# EAGLE design AD5254 Breakout Board V3 (EAGLE 6.5.0)
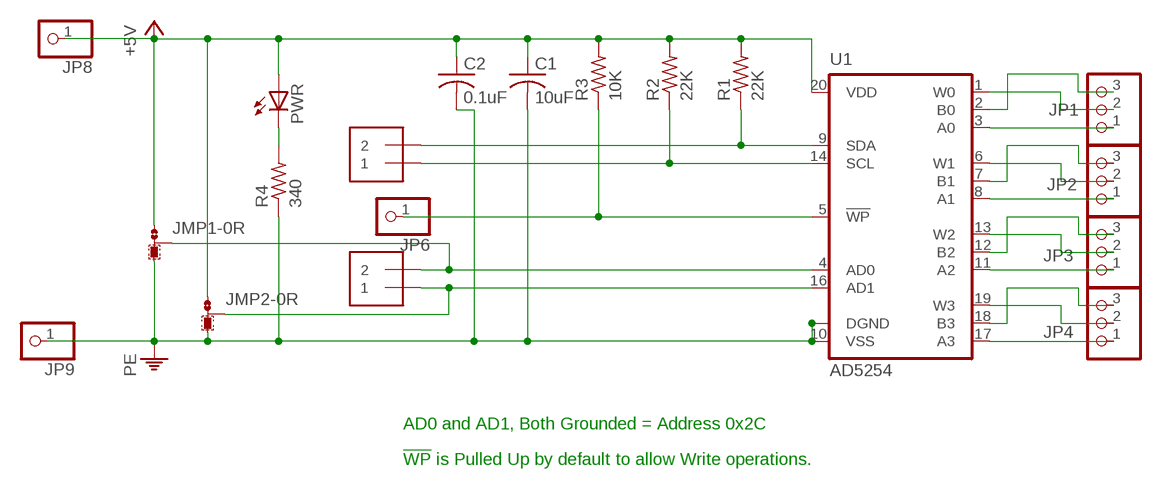
[diagram p0: schematic, sheet 1]

## Parts
C1  10uF  C-USC0805  [C0805]
C2  0.1uF  C-USC0805  [C0805]
JMP1  0R-JUMPA  [A0R-JMP]
JMP2  0R-JUMPA  [A0R-JMP]
JP1  PINHD-1X3CB  [1X03-CLEANBIG]
JP2  PINHD-1X3CB  [1X03-CLEANBIG]
JP3  PINHD-1X3CB  [1X03-CLEANBIG]
JP4  PINHD-1X3CB  [1X03-CLEANBIG]
JP5  PINHD-1X2GD  [1X02-CLEANBIG]
JP6  PINHD-1X1CB  [1X01-CLEANBIG]
JP7  PINHD-1X2GD  [1X02-CLEANBIG]
JP8  PINHD-1X1CB  [1X01-CLEANBIG]
JP9  PINHD-1X1CB  [1X01-CLEANBIG]
PWR  LED3MM  [LED3MM]
R1  22K  R-US_M0805  [M0805]
R2  22K  R-US_M0805  [M0805]
R3  10K  R-US_M0805  [M0805]
R4  340  R-US_M0805  [M0805]
U1  AD5254  [AD5254]

## Nets
+5V: C1.1 C2.1 JMP1.1 JMP2.1 JP8.1 PWR.A R1.2 R2.2 R3.2 U1.20(VDD)
GND: C1.2 C2.2 JMP1.3 JMP2.3 JP9.1 R4.1 U1.10(VSS) U1.15(DGND) ; supply symbol labelled PE
N$1: JP1.2 U1.1(W0)
N$2: JP6.1 R3.1 U1.5(!WP)
N$3: JP1.3 U1.2(B0)
N$4: JP1.1 U1.3(A0)
N$5: JP2.1 U1.8(A1)
N$6: JP3.1 U1.11(A2)
N$7: JP4.1 U1.17(A3)
N$8: JP4.3 U1.18(B3)
N$9: JP4.2 U1.19(W3)
N$10: JP2.3 U1.7(B1)
N$11: JP2.2 U1.6(W1)
N$12: JP3.3 U1.12(B2)
N$13: JP3.2 U1.13(W2)
N$14: JP5.2 R1.1 U1.9(SDA)
N$15: JP5.1 R2.1 U1.14(SCL)
N$16: JMP1.2 JP7.2 U1.4(AD0)
N$17: JMP2.2 JP7.1 U1.16(AD1)
N$18: PWR.K(C) R4.2

## Notes on the sheet
- AD0 and AD1, Both Grounded = Address 0x2C
- !WP! is Pulled Up by default to allow Write operations.

## Library data of the parts
C1 C2 = resistor:C-US: CAPACITOR, American symbol
JMP1 JMP2 = jump-0r-smd:0R-JUMP: SMD 0R 0805 Jumper
JP1-JP4 = adafruit:PINHD-1X3: PIN HEADER
JP5 JP7 = adafruit:PINHD-1X2
JP6 JP8 JP9 = adafruit:PINHD-1X1: Pin header 1x1 for 0.1" spacing With round pins
PWR = led:LED: LED OSRAM: - CHIPLED LG R971, LG N971, LY N971, LG Q971, LY Q971, LO R971, LY R971 LH N974, LH R974 LS Q976, LO Q976, LY Q976 LO Q996 - Hyper CHIPLED LW Q18S LB Q993, LB Q99A, LB R99A - SideLED LS A670, LO A670, LY A670, LG A670, LP A670 LB A673, LV A673, LT A673, LW A673 LH A674 LY A675 LS A676, LA A676, LO A676, LY A676, LW A676 LS A679, LY A679, LG A679 - Hyper Micro SIDELED® LS Y876, LA Y876, LO Y876, LY Y876 LT Y87S - SmartLED LW L88C, LW L88S LB L89C, LB L89S, LG L890 LS L89K, LO L89K, LY L89K LS L896, LA L896, LO L896, LY L896 - TOPLED LS T670, LO T670, LY T670, LG T670, LP T670 LSG T670, LSP T670, LSY T670, LOP T670, LYG T670 LG T671, LOG T671, LSG T671 LB T673, LV T673, LT T673, LW T673 LH T674 LS T676, LA T676, LO T676, LY T676, LB T676, LH T676, LSB T676, LW T676 LB T67C, LV T67C, LT T67C, LS T67K, LO T67K, LY T67K, LW E67C LS E67B, LA E67B, LO E67B, LY E67B, LB E67C, LV E67C, LT E67C LW T67C LS T679, LY T679, LG T679 LS T770, LO T770, LY T770, LG T770, LP T770 LB T773, LV T773, LT T773, LW T773 LH T774 LS E675, LA E675, LY E675, LS T675 LS T776, LA T776, LO T776, LY T776, LB T776 LHGB T686 LT T68C, LB T68C - Hyper Mini TOPLED® LB M676 - Mini TOPLED Santana® LG M470 LS M47K, LO M47K, LY M47K Source: http://www.osram.convergy.de LUXEON: - LUMILED® LXK2-PW12-R00, LXK2-PW12-S00, LXK2-PW14-U00, LXK2-PW14-V00 LXK2-PM12-R00, LXK2-PM12-S00, LXK2-PM14-U00 LXK2-PE12-Q00, LXK2-PE12-R00, LXK2-PE12-S00, LXK2-PE14-T00, LXK2-PE14-U00 LXK2-PB12-K00, LXK2-PB12-L00, LXK2-PB12-M00, LXK2-PB14-N00, LXK2-PB14-P00, LXK2-PB14-Q00 LXK2-PR12-L00, LXK2-PR12-M00, LXK2-PR14-Q00, LXK2-PR14-R00 LXK2-PD12-Q00, LXK2-PD12-R00, LXK2-PD12-S00 LXK2-PH12-R00, LXK2-PH12-S00 LXK2-PL12-P00, LXK2-PL12-Q00, LXK2-PL12-R00 Source: www.luxeon.com KINGBRIGHT: KA-3528ASYC Source: www.kingbright.com
R1-R3 = adafruit:R-US_: RESISTOR, American symbol
R4 = resistor:R-US_: RESISTOR, American symbol
U1 = AD5254 Library Part:AD5254: Quad 64-/256-Position i2C Nonvolatile Memory Digital Potentiometer

## Board
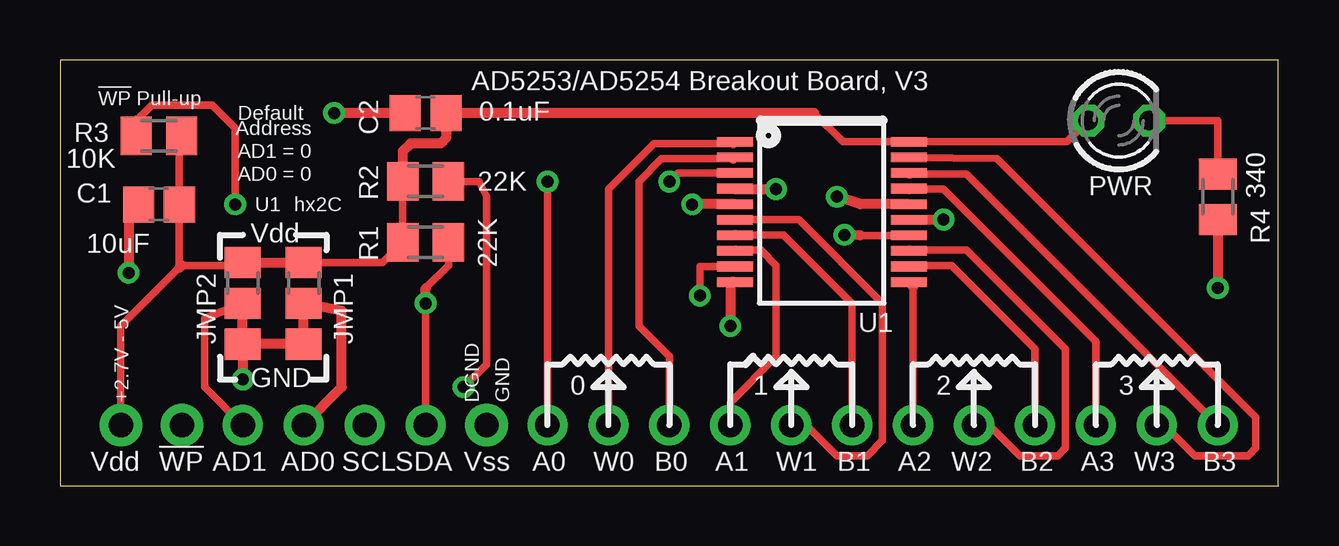
[diagram p1: board, top side]
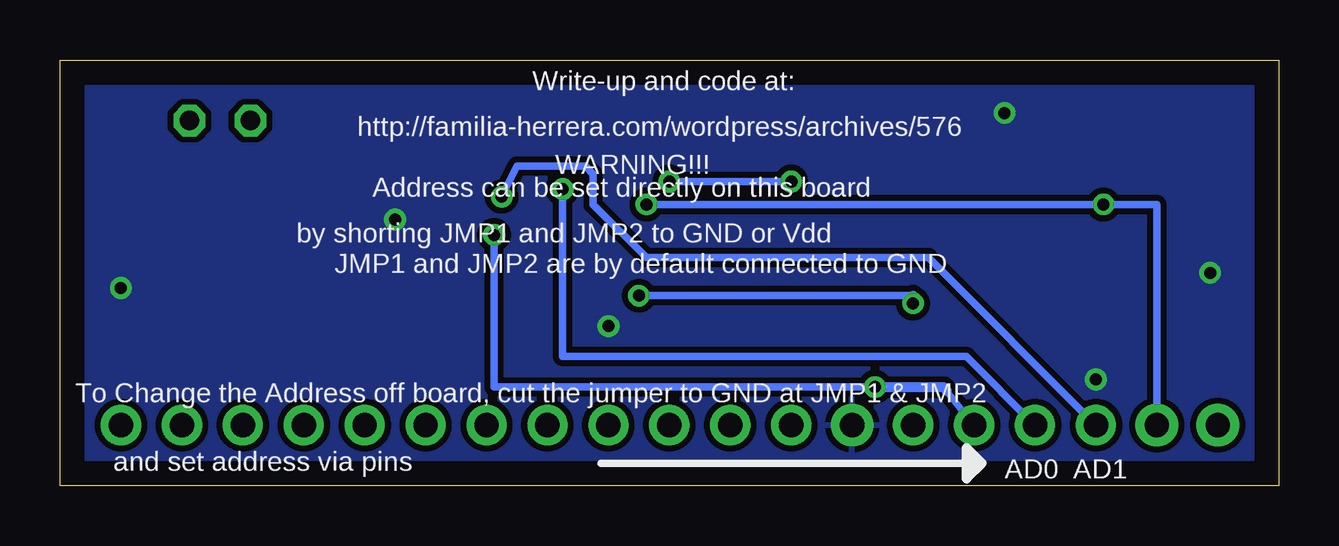
[diagram p2: board, bottom side, seen from below]

Size 50.8 x 17.77 mm. Coordinates in mm from the lower left corner, seen from the top.
Outline: 50.79,0 50.79,17.77 0,17.77 0,0 50.8,0
Copper layers (1*16): Top 0.035mm / dielectric 1.5mm / Bottom 0.035mm
Design rules "default *": minimum track width 10mil, minimum drill 24mil, track to track 8mil, track to pad 8mil, pad to pad 8mil, via to via 8mil, smd to smd 8mil, copper to edge 40mil, drill to drill 8mil, minimum pad ring 10mil, minimum via ring 8mil, stop-mask expansion 4mil, vias tented up to drill 50mil, thermal gap 10mil
tRestrict: area 29.2,7.6 to 34.3,15.2
bRestrict: area 50.5,0.3 to 50.5,5.1

### Footprints (pad centres in the part's own frame; a part is rotated, then mirrored left to right if it is on the bottom)
C0805 = smd 1.3 x 1.5: 1 -0.85,0; 2 0.85,0
A0R-JMP = smd 1.5 x 1.3: 1 0,1.7; 2 0,0; 3 0,-1.7
1X03-CLEANBIG = drill 1.016 pad 1.676: 1 -2.54,0; 2 0,0; 3 2.54,0
1X02-CLEANBIG = drill 1.016 pad 1.676: 1 -1.27,0; 2 1.27,0
1X01-CLEANBIG = drill 1.016 pad 1.778: 1 0,0
LED3MM = drill 0.813 octagon: A -1.27,0; K 1.27,0
M0805 = smd 1.3 x 1.6: 1 -0.95,0; 2 0.95,0
AD5254 = smd 0.4 x 1.5: 1 -2.925,-3.625; 2 -2.275,-3.625; 3 -1.625,-3.625; 4 -0.975,-3.625; 5 -0.325,-3.625; 6 0.325,-3.625; 7 0.975,-3.625; 8 1.625,-3.625; 9 2.275,-3.625; 10 2.925,-3.625; 11 2.925,3.625; 12 2.275,3.625; 13 1.625,3.625; 14 0.975,3.625; 15 0.325,3.625; 16 -0.325,3.625; 17 -0.975,3.625; 18 -1.625,3.625; 19 -2.275,3.625; 20 -2.925,3.625

### Placement (x,y rotation side)
C1  4.13,11.75 180 top
C2  15.24,15.56 180 top
JMP1  10.16,7.62 0 top
JMP2  7.62,7.62 0 top
JP1  22.86,2.54 0 top
JP2  30.48,2.54 0 top
JP3  38.1,2.54 0 top
JP4  45.72,2.54 0 top
JP5  13.97,2.54 0 top
JP6  5.08,2.54 0 top
JP7  8.89,2.54 0 top
JP8  2.54,2.54 0 top
JP9  17.78,2.54 0 top
PWR  44.13,15.24 0 top
R1  15.24,10.16 180 top
R2  15.24,12.7 180 top
R3  4.13,14.61 0 top
R4  48.26,12.06 90 top
U1  31.75,11.43 270 top

### Tracks (layer width: path | path; a pad name or v marks a point on that pad's centre or on a via)
+5V
  Top 0.305: JP8.1 2.54,6.67 4.98,9.11 C1.1 4.98,14.51 | 5.08,9.21 7.51,9.21 | JMP1.1 13.45,9.32 R1.2 R2.2 | PWR.A 41.98,14.36 U1.20 32.63,14.36 31.43,15.56
  Top 0.406: JMP1.1 JMP2.1 7.51,9.21 | 4.98,9.11 5.08,9.21 | 4.98,14.51 R3.2 | 31.43,15.56 C2.1 16.09,14.5 15.88,14.29 14.61,14.29 14.29,13.97 R2.2
GND  (via drill 0.5)
  Top 0.406: JMP1.3 JMP2.3 v7.62,4.45 | R4.1 v48.26,8.26 | C2.2 v11.43,15.56 | C1.2 2.86,11.75 v2.86,8.89 | U1.15 v36.83,11.11 | U1.10 27.94,8.51 v27.94,6.67
  pour Bottom (isolate 0.254): 0,17.78 50.8,17.78 50.8,0 0,0
N$1
  Top 0.305: JP1.2 22.86,12.38 24.77,14.29 28.06,14.29
  Top 0.406: 28.06,14.29 U1.1
N$2  (via drill 0.5)
  Top 0.305: v7.3,11.75 7.3,14.92 6.35,15.88 3.81,15.88 3.18,15.24
  Top 0.406: U1.5 26.68,11.76 v26.35,11.75 | R3.1 3.18,15.24
  Bottom 0.305: v26.35,11.75 7.62,11.75 v7.3,11.75 5.08,11.75 JP6.1
N$3
  Top 0.305: JP1.3 25.4,5.4 24.13,6.67 24.13,12.7 25.08,13.65 28.07,13.65
  Top 0.406: 28.07,13.65 U1.2
N$4  (via drill 0.5 pad 0.25)
  Top 0.305: U1.3 25.75,13.05 v25.4,12.7 | v20.32,12.7 JP1.1
  Bottom 0.305: v25.4,12.7 v20.32,12.7
N$5
  Top 0.305: JP2.1 27.94,3.49 29.84,5.4 29.84,9.21 29.21,9.84 28.16,9.84
  Top 0.406: 28.16,9.84 U1.8
N$6
  Top 0.305: JP3.1 35.56,8.32
  Top 0.406: 35.56,8.32 U1.11
N$7
  Top 0.305: JP4.1 43.18,6.03 36.83,12.38 35.4,12.38
  Top 0.406: 35.4,12.38 U1.17
N$8
  Top 0.305: JP4.3 37.78,13.02 35.41,13.02
  Top 0.406: 35.41,13.02 U1.18
N$9
  Top 0.305: JP4.2 46.04,2.54 47.31,1.27 49.53,1.27 49.85,1.59 49.85,2.86 39.05,13.65 U1.19
N$10
  Top 0.305: JP2.3 33.02,7.62 30.16,10.48 28.15,10.48
  Top 0.406: 28.15,10.48 U1.7
N$11
  Top 0.305: JP2.2 31.11,2.54 32.38,1.27 33.66,1.27 34.29,1.91 34.29,7.62 30.8,11.11 28.13,11.11
  Top 0.406: 28.13,11.11 U1.6
N$12
  Top 0.305: JP3.3 40.64,5.71 37.15,9.21 35.43,9.21 U1.12
N$13
  Top 0.305: JP3.2 38.73,2.54 40.01,1.27 41.59,1.27 41.91,1.59 41.91,5.71 37.78,9.84 35.41,9.84
  Top 0.406: 35.41,9.84 U1.13
N$14  (via drill 0.5)
  Top 0.305: 15.24,8.26 16.19,9.21 R1.1 | U1.9 26.67,9.15 v26.67,7.94 | v15.24,7.62 JP5.2
  Top 0.406: v15.24,7.62 15.24,8.26
  Bottom 0.305: v26.67,7.94 15.24,7.94
  Bottom 0.406: 15.24,7.94 v15.24,7.62
N$15  (via drill 0.5)
  Top 0.305: U1.14 33.36,10.46 | R2.1 17.46,12.7 17.78,12.06 17.78,5.08 v16.83,4.13
  Top 0.406: 33.36,10.46 v32.7,10.48
  Bottom 0.305: v32.7,10.48 32.7,4.13 v16.83,4.13 14,4.13 13.85,3.97 JP5.1
  Bottom 0.406: v16.83,4.13 13.97,4.13 13.85,3.97
N$16  (via drill 0.5)
  Top 0.406: 10.16,6.03 JMP1.2 11.75,7.3 11.75,4.13 JP7.2 | U1.4 28.15,12.38 v29.84,12.38
  Bottom 0.305: v29.84,12.38 29.84,5.4 13.02,5.4 JP7.2
N$17  (via drill 0.5)
  Top 0.305: JP7.1 6.03,4.13 6.03,6.99 JMP2.2
  Top 0.406: 7.62,6.03 JMP2.2 | U1.16 33.34,11.76 v32.38,12.06
  Bottom 0.305: v32.38,12.06 31.75,13.34 28.89,13.34 28.57,13.02 28.57,11.75 26.35,9.53 14.61,9.53 JP7.1
N$18
  Top 0.305: R4.2 48.26,15.24 PWR.K

### Text on the board
tNames: AD5253/AD5254 Breakout Board, V3 | !WP! Pull-up | Default | Address | 0.1uF | AD1 = 0 | AD0 = 0 | U1 | hx2C | Vdd | GND | 0 | 1 | 2 | 3 | +2.7V - 5V | DGND | GND | Vdd | !WP | AD1 | AD0 | SCL | SDA | Vss | A0 | W0 | B0 | A1 | W1 | B1 | A2 | W2 | B2 | A3 | W3 | B3
bNames: Write-up and code at: | http://familia-herrera.com/wordpress/archives/576 | WARNING!!! | Address can be set directly on this board | by shorting JMP1 and JMP2 to GND or Vdd | JMP1 and JMP2 are by default connected to GND | To Change the Address off board, cut the jumper to GND at JMP1 & JMP2 | and set address via pins | AD1 | AD0